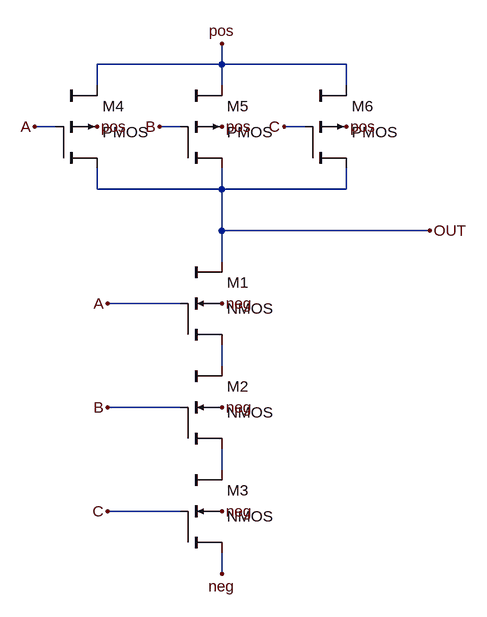
[diagram p0: schematic NAND3.asc]
NAND3.asc, the LTspice schematic file:
Version 4
SHEET 1 880 780
WIRE 224 -96 224 -128
WIRE 224 -96 32 -96
WIRE 416 -96 224 -96
WIRE 32 -64 32 -96
WIRE 224 -64 224 -96
WIRE 416 -64 416 -96
WIRE -32 0 -64 0
WIRE 160 0 128 0
WIRE 352 0 320 0
WIRE 32 96 32 64
WIRE 224 96 224 64
WIRE 224 96 32 96
WIRE 416 96 416 64
WIRE 416 96 224 96
WIRE 224 160 224 96
WIRE 544 160 224 160
WIRE 224 208 224 160
WIRE 160 272 48 272
WIRE 224 368 224 336
WIRE 160 432 48 432
WIRE 224 528 224 496
WIRE 160 592 48 592
WIRE 224 688 224 656
FLAG -64 0 A
FLAG 48 272 A
FLAG 48 432 B
FLAG 544 160 OUT
FLAG 224 -128 pos
FLAG 128 0 B
FLAG 320 0 C
FLAG 224 688 neg
FLAG 224 592 neg
FLAG 224 432 neg
FLAG 224 272 neg
FLAG 32 0 pos
FLAG 224 0 pos
FLAG 416 0 pos
FLAG 48 592 C
SYMBOL cktsym\\nmos4 224 272 R0
SYMATTR InstName M1
SYMATTR Value2 l=nmosL w=nmosW
SYMBOL cktsym\\nmos4 224 432 R0
SYMATTR InstName M2
SYMATTR Value2 l=nmosL w=nmosW
SYMBOL cktsym\\pmos4 32 0 R0
SYMATTR InstName M4
SYMATTR Value2 l=pmosL w=pmosW
SYMBOL cktsym\\nmos4 224 592 R0
SYMATTR InstName M3
SYMATTR Value2 l=nmosL w=nmosW
SYMBOL cktsym\\pmos4 224 0 R0
SYMATTR InstName M5
SYMATTR Value2 l=pmosL w=pmosW
SYMBOL cktsym\\pmos4 416 0 R0
SYMATTR InstName M6
SYMATTR Value2 l=pmosL w=pmosW

The netlist it stands for:
* NAND3.asc
M1 OUT A N001 neg NMOS l=nmosL w=nmosW
M2 N001 B N002 neg NMOS l=nmosL w=nmosW
M4 OUT A pos pos PMOS l=pmosL w=pmosW
M3 N002 C neg neg NMOS l=nmosL w=nmosW
M5 OUT B pos pos PMOS l=pmosL w=pmosW
M6 OUT C pos pos PMOS l=pmosL w=pmosW
.model NMOS NMOS
.model PMOS PMOS
.lib standard.mos
.backanno
.end